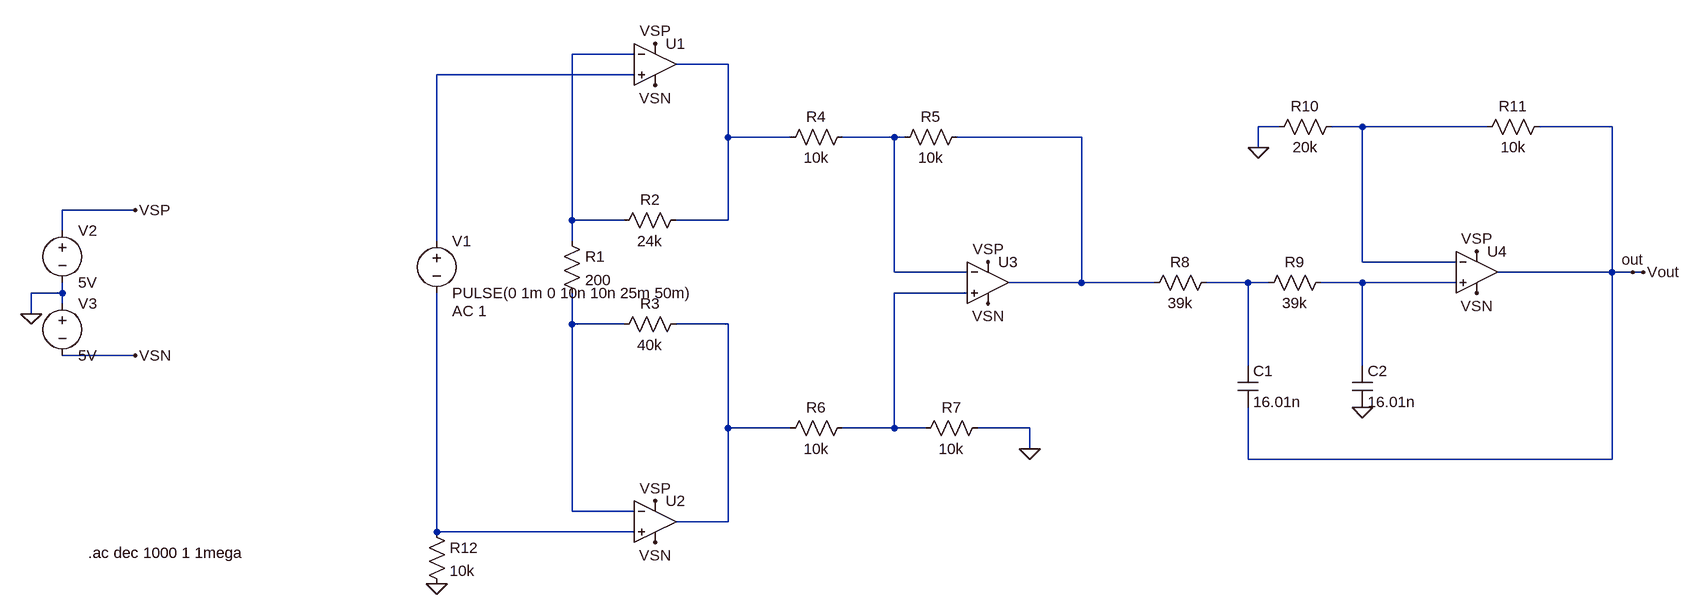
[diagram p0: schematic Maracineanu_Tudor_ProiectEA.asc]
Maracineanu_Tudor_ProiectEA.asc, the LTspice schematic file:
Version 4
SHEET 1 2632 680
WIRE 1008 -224 912 -224
WIRE 1152 -208 1072 -208
WIRE 1008 -192 704 -192
WIRE 2000 -112 1968 -112
WIRE 2128 -112 2080 -112
WIRE 2320 -112 2128 -112
WIRE 2512 -112 2400 -112
WIRE 1152 -96 1152 -208
WIRE 1248 -96 1152 -96
WIRE 1408 -96 1328 -96
WIRE 1424 -96 1408 -96
WIRE 1696 -96 1504 -96
WIRE 1968 -80 1968 -112
WIRE 240 16 128 16
WIRE 912 32 912 -224
WIRE 992 32 912 32
WIRE 1152 32 1152 -96
WIRE 1152 32 1072 32
WIRE 128 48 128 16
WIRE 704 64 704 -192
WIRE 912 64 912 32
WIRE 2128 96 2128 -112
WIRE 2272 96 2128 96
WIRE 1408 112 1408 -96
WIRE 1520 112 1408 112
WIRE 2512 112 2512 -112
WIRE 2512 112 2336 112
WIRE 2544 112 2512 112
WIRE 2560 112 2544 112
WIRE 1696 128 1696 -96
WIRE 1696 128 1584 128
WIRE 1808 128 1696 128
WIRE 1952 128 1888 128
WIRE 1984 128 1952 128
WIRE 2128 128 2064 128
WIRE 2272 128 2128 128
WIRE 128 144 128 128
WIRE 128 144 80 144
WIRE 1520 144 1408 144
WIRE 128 160 128 144
WIRE 80 176 80 144
WIRE 912 192 912 144
WIRE 992 192 912 192
WIRE 1152 192 1072 192
WIRE 240 240 128 240
WIRE 1952 256 1952 128
WIRE 2128 256 2128 128
WIRE 1152 352 1152 192
WIRE 1248 352 1152 352
WIRE 1408 352 1408 144
WIRE 1408 352 1328 352
WIRE 1456 352 1408 352
WIRE 1616 352 1536 352
WIRE 1616 384 1616 352
WIRE 1952 400 1952 320
WIRE 2512 400 2512 112
WIRE 2512 400 1952 400
WIRE 912 480 912 192
WIRE 1008 480 912 480
WIRE 1152 496 1152 352
WIRE 1152 496 1072 496
WIRE 704 512 704 144
WIRE 1008 512 704 512
FLAG 80 176 0
FLAG 240 16 VSP
FLAG 240 240 VSN
FLAG 704 592 0
FLAG 1040 -176 VSN
FLAG 1040 -240 VSP
FLAG 1040 464 VSP
FLAG 1040 528 VSN
FLAG 1616 384 0
FLAG 1552 160 VSN
FLAG 1552 96 VSP
FLAG 2128 320 0
FLAG 1968 -80 0
FLAG 2304 80 VSP
FLAG 2304 144 VSN
FLAG 2560 112 Vout
FLAG 2544 112 out
SYMBOL voltage 128 32 R0
SYMATTR InstName V2
SYMATTR Value 5V
SYMBOL voltage 128 144 R0
WINDOW 123 0 0 Left 0
WINDOW 39 0 0 Left 0
SYMATTR InstName V3
SYMATTR Value 5V
SYMBOL voltage 704 48 R0
WINDOW 123 24 124 Left 2
WINDOW 39 0 0 Left 0
SYMATTR InstName V1
SYMATTR Value PULSE(0 1m 0 10n 10n 25m 50m)
SYMATTR Value2 AC 1
SYMBOL res 688 496 R0
SYMATTR InstName R12
SYMATTR Value 10k
SYMBOL res 896 48 R0
SYMATTR InstName R1
SYMATTR Value 200
SYMBOL res 1088 16 R90
WINDOW 0 0 56 VBottom 2
WINDOW 3 32 56 VTop 2
SYMATTR InstName R2
SYMATTR Value 24k
SYMBOL res 1088 176 R90
WINDOW 0 0 56 VBottom 2
WINDOW 3 32 56 VTop 2
SYMATTR InstName R3
SYMATTR Value 40k
SYMBOL Opamps\\UniversalOpamp2 1040 496 R0
SYMATTR InstName U2
SYMBOL Opamps\\UniversalOpamp2 1040 -208 R0
SYMATTR InstName U1
SYMBOL Opamps\\UniversalOpamp2 1552 128 R0
SYMATTR InstName U3
SYMBOL res 1520 -112 R90
WINDOW 0 0 56 VBottom 2
WINDOW 3 32 56 VTop 2
SYMATTR InstName R5
SYMATTR Value 10k
SYMBOL res 1344 -112 R90
WINDOW 0 0 56 VBottom 2
WINDOW 3 32 56 VTop 2
SYMATTR InstName R4
SYMATTR Value 10k
SYMBOL res 1344 336 R90
WINDOW 0 0 56 VBottom 2
WINDOW 3 32 56 VTop 2
SYMATTR InstName R6
SYMATTR Value 10k
SYMBOL res 1552 336 R90
WINDOW 0 0 56 VBottom 2
WINDOW 3 32 56 VTop 2
SYMATTR InstName R7
SYMATTR Value 10k
SYMBOL res 1904 112 R90
WINDOW 0 0 56 VBottom 2
WINDOW 3 32 56 VTop 2
SYMATTR InstName R8
SYMATTR Value 39k
SYMBOL cap 1936 256 R0
SYMATTR InstName C1
SYMATTR Value 16.01n
SYMBOL res 2080 112 R90
WINDOW 0 0 56 VBottom 2
WINDOW 3 32 56 VTop 2
SYMATTR InstName R9
SYMATTR Value 39k
SYMBOL cap 2112 256 R0
SYMATTR InstName C2
SYMATTR Value 16.01n
SYMBOL Opamps\\UniversalOpamp2 2304 112 R0
SYMATTR InstName U4
SYMBOL res 2304 -96 R270
WINDOW 0 32 56 VTop 2
WINDOW 3 0 56 VBottom 2
SYMATTR InstName R11
SYMATTR Value 10k
SYMBOL res 2096 -128 R90
WINDOW 0 0 56 VBottom 2
WINDOW 3 32 56 VTop 2
SYMATTR InstName R10
SYMATTR Value 20k
TEXT 168 544 Left 2 !.ac dec 1000 1 1mega

The netlist it stands for:
* Maracineanu_Tudor_ProiectEA.asc
V2 VSP 0 5V
V3 0 VSN 5V
V1 N003 N012 PULSE(0 1m 0 10n 10n 25m 50m) AC 1
R12 N012 0 10k
R1 N001 N010 200
R2 N002 N001 24k
R3 N011 N010 40k
XU2 N012 N010 VSP VSN N011 level.2 Avol=1Meg GBW=10Meg Slew=10Meg ilimit=25m rail=0 Vos=0 phimargin=45 en=0 enk=0 in=0 ink=0 Rin=500Meg  ; pins IN+ IN- V+ V- OUT
XU1 N003 N001 VSP VSN N002 level.2 Avol=1Meg GBW=10Meg Slew=10Meg ilimit=25m rail=0 Vos=0 phimargin=45 en=0 enk=0 in=0 ink=0 Rin=500Meg  ; pins IN+ IN- V+ V- OUT
XU3 N009 N005 VSP VSN N006 level.2 Avol=1Meg GBW=10Meg Slew=10Meg ilimit=25m rail=0 Vos=0 phimargin=45 en=0 enk=0 in=0 ink=0 Rin=500Meg  ; pins IN+ IN- V+ V- OUT
R5 N006 N005 10k
R4 N005 N002 10k
R6 N009 N011 10k
R7 0 N009 10k
R8 N007 N006 39k
C1 N007 out 16.01n
R9 N008 N007 39k
C2 N008 0 16.01n
XU4 N008 N004 VSP VSN out level.2 Avol=1Meg GBW=10Meg Slew=10Meg ilimit=25m rail=0 Vos=0 phimargin=45 en=0 enk=0 in=0 ink=0 Rin=500Meg  ; pins IN+ IN- V+ V- OUT
R11 N004 out 10k
R10 N004 0 20k
.ac dec 1000 1 1mega
.lib UniversalOpamps2.sub
.backanno
.end